# Altium schematic sheet Alpha_schematic.SchDoc
size A4; SheetNumber: 1; SheetTotal: 1
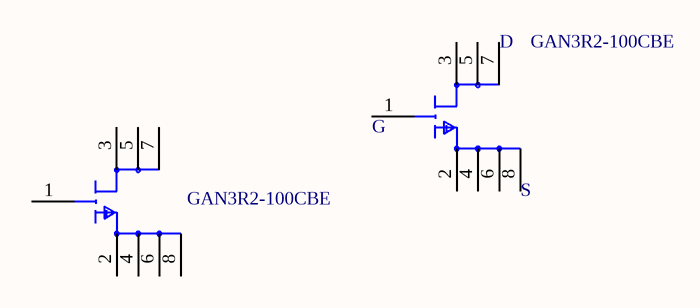
[diagram p0: Alpha_schematic.SchDoc]

## Parts
(Parts that share a designator on the sheet are numbered #1, #2 ... from top to bottom, then left to right.)
?#1  GAN3R2-100CBE  [FP-WLCSP8-SOT8072-MFG]
?#2  GAN3R2-100CBE  [FP-WLCSP8-SOT8072-MFG]

## Nets

Not connected (* = marked no-connect by the designer): ?#1 1(G) 2(S) 3(D) 4(S) 5(D) 6(S) 7(D) 8(S); ?#2 1(G) 2(S) 3(D) 4(S) 5(D) 6(S) 7(D) 8(S)

## Library data of the parts
?#1 = GAN3R2-100CBE_1: GAN3R2-100CBE                                                                                                                                                                                                                                                     100 V, 3.2 mOhm Gallium Nitride (GaN) FET in a 3.5 mm x 2.13 mm Wafer Level Chip; NexarPartId: 136220986; Drain to Source Resistance: 2.4mΩ; Power Dissipation: 394W; Number of Channels: 1; Drain to Source Voltage (Vdss): 100V; Gate to Source Voltage (Vgs): -4V; Max Junction Temperature (Tj): 150°C; Continuous Drain Current (ID): 60A; Height: 464µm; Max Operating Temperature: 150°C; Min Operating Temperature: -40°C; Drain to Source Breakdown Voltage: 100V; MPN: GAN3R2-100CBE
?#2 = CMP-11424-136220986-1: GAN3R2-100CBEAZ 100 V, 3.2 mOhm Gallium Nitride (GaN) FET in a 3.5 mm x 2.13 mm Wafer Level Chip; Drain to Source Resistance: 2.4mΩ; Power Dissipation: 394W; Number of Channels: 1; Drain to Source Voltage (Vdss): 100V; Gate to Source Voltage (Vgs): -4V; Max Junction Temperature (Tj): 150°C; Continuous Drain Current (ID): 60A; Height: 464µm; Max Operating Temperature: 150°C; Min Operating Temperature: -40°C; Drain to Source Breakdown Voltage: 100V; NexarPartId: 136220986